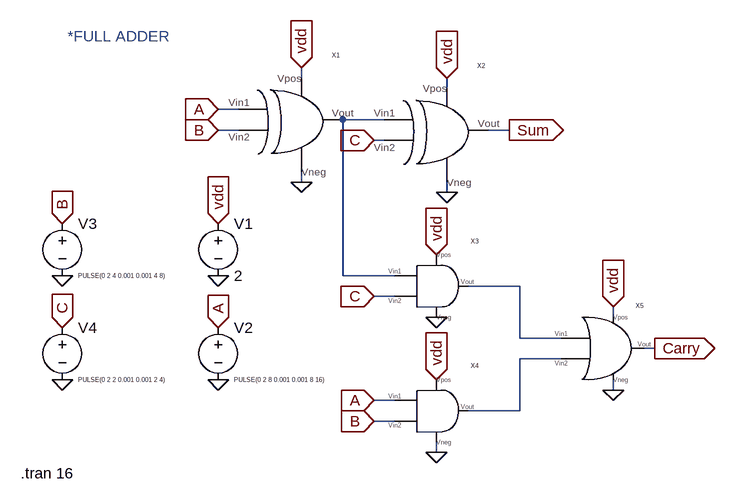
[diagram p0: schematic FULL ADDER.asc]
FULL ADDER.asc, the LTspice schematic file:
Version 4
SHEET 1 976 692
WIRE 272 32 272 16
WIRE 496 48 496 32
WIRE 176 80 144 80
WIRE 400 96 336 96
WIRE 176 112 144 112
WIRE 592 112 560 112
WIRE 400 128 384 128
WIRE 272 192 272 176
WIRE 496 208 496 192
WIRE 336 336 336 96
WIRE 416 336 336 336
WIRE 608 352 528 352
WIRE 416 368 384 368
WIRE 752 400 752 384
WIRE 608 432 608 352
WIRE 672 432 608 432
WIRE 816 448 800 448
WIRE 672 464 608 464
WIRE 752 512 752 496
WIRE 416 528 384 528
WIRE 608 544 608 464
WIRE 608 544 528 544
WIRE 416 560 384 560
WIRE 480 608 480 592
FLAG 272 192 0
FLAG 496 208 0
FLAG 480 400 0
FLAG 480 608 0
FLAG 144 256 vdd
IOPIN 144 256 In
FLAG 272 16 vdd
IOPIN 272 16 In
FLAG 496 32 vdd
IOPIN 496 32 In
FLAG 480 304 vdd
IOPIN 480 304 In
FLAG 752 384 vdd
IOPIN 752 384 In
FLAG 480 496 vdd
IOPIN 480 496 In
FLAG 144 80 A
IOPIN 144 80 In
FLAG 144 416 A
IOPIN 144 416 In
FLAG 384 528 A
IOPIN 384 528 In
FLAG 384 560 B
IOPIN 384 560 In
FLAG -96 256 B
IOPIN -96 256 In
FLAG 384 368 C
IOPIN 384 368 In
FLAG 384 128 C
IOPIN 384 128 In
FLAG -96 416 C
IOPIN -96 416 In
FLAG 144 112 B
IOPIN 144 112 In
FLAG 592 112 Sum
IOPIN 592 112 Out
FLAG 816 448 Carry
IOPIN 816 448 Out
FLAG 752 512 0
FLAG 144 336 0
FLAG -96 336 0
FLAG -96 496 0
FLAG 144 496 0
SYMBOL xor 320 80 R0
SYMATTR InstName X1
SYMBOL xor 544 96 R0
SYMATTR InstName X2
SYMBOL and 512 352 R0
SYMATTR InstName X3
SYMBOL and 512 544 R0
SYMATTR InstName X4
SYMBOL or 496 448 R0
SYMATTR InstName X5
SYMBOL voltage 144 240 R0
WINDOW 123 0 0 Left 0
WINDOW 39 0 0 Left 0
SYMATTR InstName V1
SYMATTR Value 2
SYMBOL voltage 144 400 R0
WINDOW 3 24 96 Left 0
WINDOW 123 0 0 Left 0
WINDOW 39 0 0 Left 0
SYMATTR Value PULSE(0 2 8 0.001 0.001 8 16)
SYMATTR InstName V2
SYMBOL voltage -96 240 R0
WINDOW 3 24 96 Left 0
WINDOW 123 0 0 Left 0
WINDOW 39 0 0 Left 0
SYMATTR Value PULSE(0 2 4 0.001 0.001 4 8)
SYMATTR InstName V3
SYMBOL voltage -96 400 R0
WINDOW 3 24 96 Left 0
WINDOW 123 0 0 Left 0
WINDOW 39 0 0 Left 0
SYMATTR Value PULSE(0 2 2 0.001 0.001 2 4)
SYMATTR InstName V4
TEXT -160 640 Left 2 !.tran 16
TEXT -88 -32 Left 2 ;*FULL ADDER

The netlist it stands for:
* FULL ADDER.asc
XX1 A B vdd 0 N001 xor  ; pins A B vdd gnd Y
XX2 N001 C vdd 0 Sum xor  ; pins A B vdd gnd Y
XX3 vdd N001 C 0 N002 and  ; pins vdd A B gnd Y
XX4 vdd A B 0 N003 and  ; pins vdd A B gnd Y
XX5 vdd N002 N003 0 Carry or  ; pins vdd A B gnd Y
V1 vdd 0 2
V2 A 0 PULSE(0 2 8 0.001 0.001 8 16)
V3 B 0 PULSE(0 2 4 0.001 0.001 4 8)
V4 C 0 PULSE(0 2 2 0.001 0.001 2 4)
.tran 16
* *FULL ADDER
.backanno
.end